# Altium schematic sheet HA_Ard.SchDoc: Ard connectors
size A4; PageSetup: Record=PageOptions|CenterHorizontal=True|CenterVertical=True|PrintScale=1.02|XCorrection=1.00|YCorrection=1.00|PrintKind=0|BorderSize=5000000|LeftOffset=0|BottomOffset=0|Orientation=2|PaperLength=1000|PaperWidth=1000|Scale=100|PaperSource=257|PrintQuality=-3|MediaType=1|DitherType=10|PrintScaleMode=1|PaperKind=A4 (Borderless)|PaperIndex=123
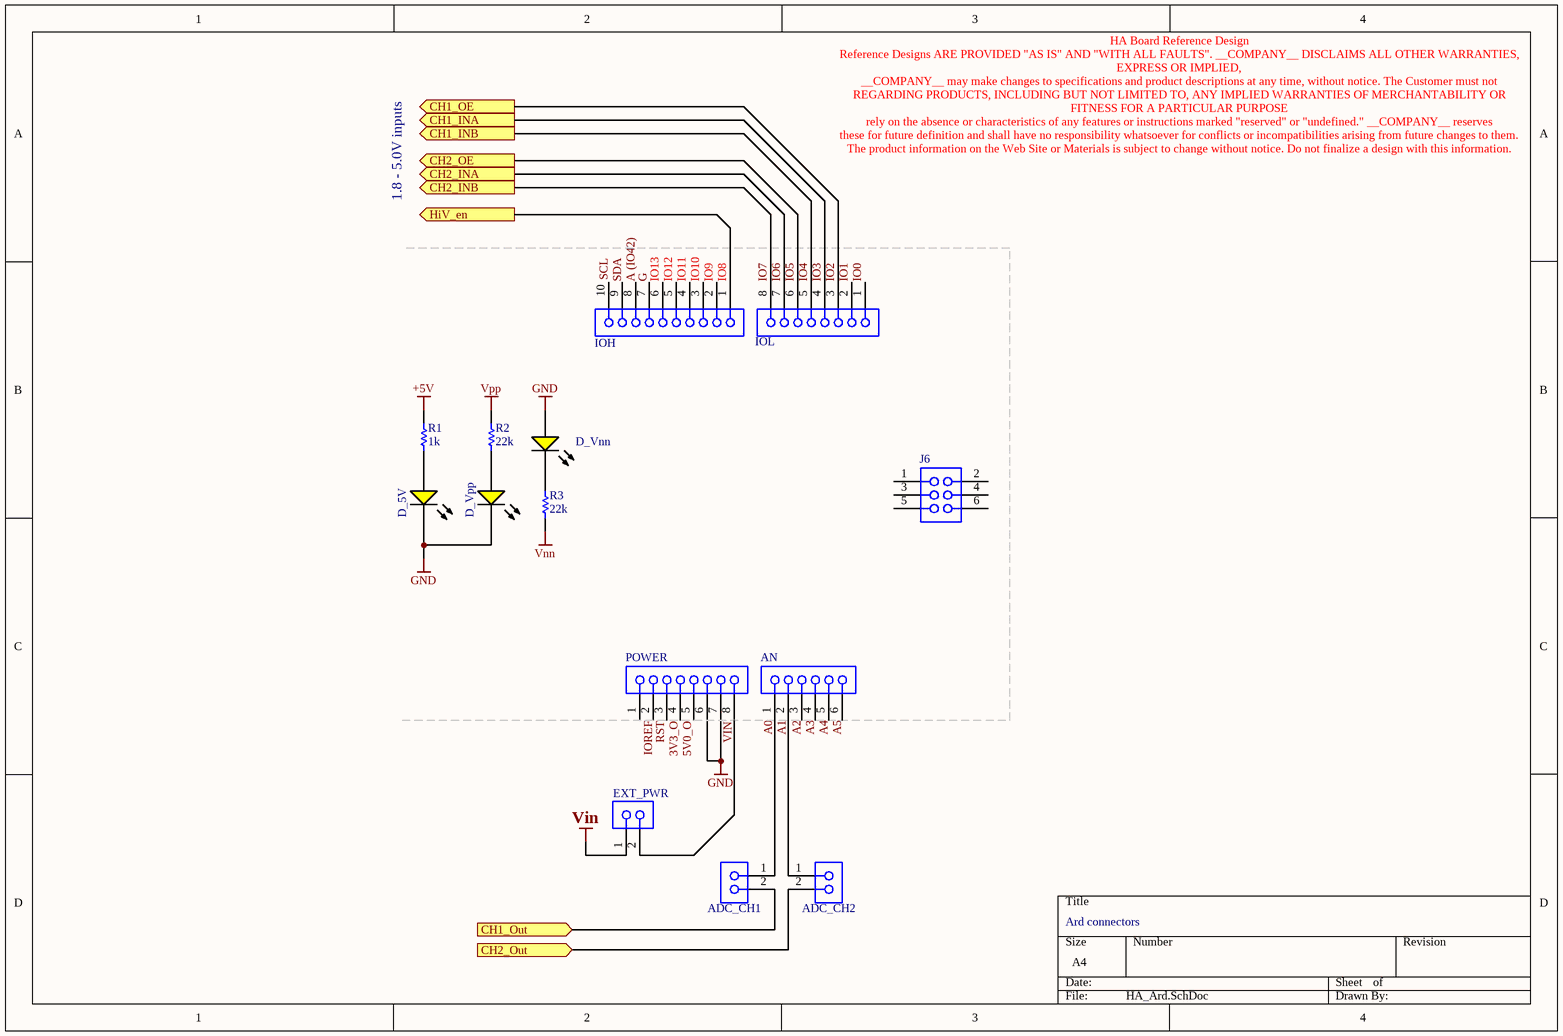
[diagram p0: HA_Ard.SchDoc]

## Parts
ADC_CH1  PHF-102-03-L-S  [SMTC-PHF-102-03-X-S]  (value not drawn)
ADC_CH2  PHF-102-03-L-S  [SMTC-PHF-102-03-X-S]  (value not drawn)
AN  SSW-106-02-G-S  [SMTC-SSW-106-02-X-S]  (value not drawn)
D_5V  LED 0603 Green  [LTST-C190KSKT_V]  (value not drawn)
D_Vnn  LED 0603 Green  [LTST-C190KSKT_V]  (value not drawn)
D_Vpp  LED 0603 Green  [LTST-C190KSKT_V]  (value not drawn)
EXT_PWR  PHF-102-03-L-S  [SMTC-PHF-102-03-X-S]  (value not drawn)
IOH  SSW-110-03-G-S  [SMTC-SSW-110-03-X-S]  (value not drawn)
IOL  SSQ-108-01-F-S  [SMTC-SSQ-108-01-X-S]  (value not drawn)
J6  SSW-103-01-F-D  [SMTC-SSW-103-01-X-D]  (value not drawn)
POWER  SSQ-108-01-F-S  [SMTC-SSQ-108-01-X-S]  (value not drawn)
R1  1k  [RESC0603(1608)_N]
R2  22k  [RESC0603(1608)_N]
R3  22k  [RESC0603(1608)_N]

## Ports
CH1_INA (out), CH1_INB (out), CH1_OE (out), CH1_Out (in), CH2_INA (out), CH2_INB (out), CH2_OE (out), CH2_Out (in), HiV_en (out)

## Nets
+5V: R1.1
GND: D_5V.2(K) D_Vnn.1(A) D_Vpp.2(K) POWER.6 POWER.7
Vin: EXT_PWR.1
Vnn: R3.1
Vpp: R2.1
CH1_Out: ADC_CH1.2 ; port CH1_Out
CH2_Out: ADC_CH2.2 ; port CH2_Out
HiV_en: IOH.1 ; port HiV_en
IO0: IOL.1
IO1: IOL.2
IO2: IOL.3 ; port CH1_OE
IO3: IOL.4 ; port CH1_INA
IO4: IOL.5 ; port CH1_INB
IO5: IOL.6 ; port CH2_OE
IO6: IOL.7 ; port CH2_INA
IO7: IOL.8 ; port CH2_INB
NetADC_CH1_1: ADC_CH1.1 AN.1
NetADC_CH2_1: ADC_CH2.1 AN.2
NetD_5V_1: D_5V.1(A) R1.2
NetD_Vnn_2: D_Vnn.2(K) R3.2
NetD_Vpp_1: D_Vpp.1(A) R2.2
NetEXT_PWR_2: EXT_PWR.2 POWER.8

Not connected (* = marked no-connect by the designer): AN 3 4 5 6; IOH 2 3 4 5 6 7 8 9 10; J6 1 2 3 4 5 6; POWER 1 2 3 4 5

## Notes on the sheet
- 1.8 - 5.0V inputs
- HA Board Reference Design
  Reference Designs ARE PROVIDED "AS IS" AND "WITH ALL FAULTS". __COMPANY__ DISCLAIMS ALL OTHER WARRANTIES, EXPRESS OR IMPLIED,
  __COMPANY__ may make changes to specifications and product descriptions at any time, without notice. The Customer must not
  REGARDING PRODUCTS, INCLUDING BUT NOT LIMITED TO, ANY IMPLIED WARRANTIES OF MERCHANTABILITY OR FITNESS FOR A PARTICULAR PURPOSE
  rely on the absence or characteristics of any features or instructions marked "reserved" or "undefined." __COMPANY__ reserves
  these for future definition and shall have no responsibility whatsoever for conflicts or incompatibilities arising from future changes to them.
  The product information on the Web Site or Materials is subject to change without notice. Do not finalize a design with this information.
- (near IOH) IO13
- (near IOH) IO12
- (near IOH) IO11
- (near IOH) IO10
- (near IOH) IO9
- (near IOH) IO8
- Labels drawn without touching a wire or pin: 3V3_O, 5V0_O, A0, A1, A2, A3, A4, A5, A (IO42), G, IOREF, RST, SCL, SDA, VIN
- Title
- Size:
- Date:
- A4
- Number:
- Time:
- Revision:
- Sheet
- of
- File:

## Library data of the parts
ADC_CH1 ADC_CH2 EXT_PWR = CMP-1023-00105-1: Press Fit Socket, Through-hole, Vertical, -55 to 125 degC, 2.54 mm Pitch, 2-Pin, Female, RoHS; Manufacturer: Samtec; Pitch: 2.54 mm; Orientation: Vertical; RoHS: True; DatasheetVersion: F-214; PackageReference: PHF-102-03-X-S; Temperature Range: -55 to 125 degC; ComponentLink1Description: Manufacturer URL; ComponentLink3Description: Package Specification; PackageVersion: F, 9/2009; ComponentLink2Description: Datasheet; ComponentLink3URL: http://www.samtec.com/documents/webfiles/cpdf/PHF-1XX-XX-X-X-XXX-MKT.pdf; PartNumber: PHF-102-03-L-S; ComponentLink1URL: http://www.samtec.com; ComponentLink2URL: http://www.samtec.com/documents/webfiles/pdf/phf.pdf; Mounting Technology: Through-hole; PackageDescription: .100 Press Fit Socket Assembly
AN = CMP-1023-00359-1: SQ Post Socket, Through-hole, Vertical, -55 to 125 degC, 2.54mm Pitch, 6-Pin, Female, RoHS; Manufacturer: Samtec; ComponentLink1Description: Manufacturer URL; Pitch: 2.54 mm; ComponentLink1URL: http://www.samtec.com; ComponentLink2Description: Datasheet; PackageVersion: CA, 6/1987; Orientation: Vertical; RoHS: True; PackageReference: SSW-106-02-X-S; ComponentLink2URL: http://www.samtec.com/documents/webfiles/pdf/SSW_TH.PDF; Mounting Technology: Through-hole; Temperature Range: -55 to 125 degC; PackageDescription: Assembly, Socket Strip .016 X .031 Tail; DatasheetVersion: F-214; ComponentLink3Description: Package Specification; PartNumber: SSW-106-02-G-S; ComponentLink3URL: http://www.samtec.com/documents/webfiles/cpdf/SSW-1XX-XX-XXX-X-XX-XXX-XX-MKT.pdf
D_5V D_Vnn = CMP-1674-00009-1: Manufacturer: Vishay; MPN: TLMG1100-GS08; Value: LED 0603 Green
D_Vpp = CMP-1674-00009-1: MPN: TLMG1100-GS08; Manucturer: Vishay; Value: LED 0603 Green
IOH = CMP-1023-00394-1: SQ Post Socket, Through-hole, Vertical, -55 to 125 degC, 2.54 mm Pitch, 10-Pin, Female, RoHS; Manufacturer: Samtec; Pitch: 2.54 mm; PartNumber: SSW-110-03-G-S; ComponentLink2Description: Datasheet; ComponentLink3URL: http://www.samtec.com/documents/webfiles/cpdf/SSW-1XX-XX-XXX-X-XX-XXX-XX-MKT.pdf; ComponentLink1URL: http://www.samtec.com; RoHS: True; ComponentLink1Description: Manufacturer URL; ComponentLink2URL: http://www.samtec.com/documents/webfiles/pdf/SSW_TH.PDF; Temperature Range: -55 to 125 degC; PackageDescription: Assembly, Socket Strip .016 X .031 Tail; ComponentLink3Description: Package Specification; PackageReference: SSW-110-03-X-S; Orientation: Vertical; DatasheetVersion: F-214; PackageVersion: CA, 6/1987; Mounting Technology: Through-hole
IOL POWER = CMP-1023-00294-1: SQ Post Socket, Through-hole, Vertical, -55 to 125 degC, 2.54 mm Pitch, 8-Pin, Female, RoHS; Manufacturer: Samtec; Pitch: 2.54 mm; ComponentLink3URL: http://www.samtec.com/documents/webfiles/cpdf/SSQ-1XX-XX-XXX-X-XX-XXX-XX-X-MKT.pdf; ComponentLink2URL: http://www.samtec.com/documents/webfiles/pdf/SSQ_TH.PDF; Mounting Technology: Through-hole; PackageReference: SSQ-108-01-X-S; Orientation: Vertical; PackageDescription: Assembly, Socket Strip .025[0.64] SQ Tail; ComponentLink2Description: Datasheet; PartNumber: SSQ-108-01-F-S; Temperature Range: -55 to 125 degC; ComponentLink1URL: http://www.samtec.com; ComponentLink3Description: Package Specification; PackageVersion: BD, 6/1987; RoHS: True; ComponentLink1Description: Manufacturer URL; DatasheetVersion: F-214
J6 = CMP-1023-00329-1: SQ Post Socket, Through-hole, Vertical, -55 to 125 degC, 2.54 mm Pitch, 6-Pin, Female, RoHS; Manufacturer: Samtec; Pitch: 2.54 mm; Temperature Range: -55 to 125 degC; ComponentLink3URL: http://www.samtec.com/documents/webfiles/cpdf/SSW-1XX-XX-XXX-X-XX-XXX-XX-MKT.pdf; ComponentLink1URL: http://www.samtec.com; Orientation: Vertical; PackageReference: SSW-103-01-X-D; RoHS: True; ComponentLink1Description: Manufacturer URL; PartNumber: SSW-103-01-F-D; PackageVersion: CA, 6/1987; ComponentLink2URL: http://www.samtec.com/documents/webfiles/pdf/SSW_TH.PDF; ComponentLink3Description: Package Specification; Mounting Technology: Through-hole; PackageDescription: Assembly, Socket Strip .016 X .031 Tail; DatasheetVersion: F-214; ComponentLink2Description: Datasheet
R1 = CMP-1012-00122-1: Tolerance: 1 %; Value: 1k
R2 R3 = CMP-1012-00122-1: 1% 0603 SMD; Value: 22k; Tolerance: 1 %